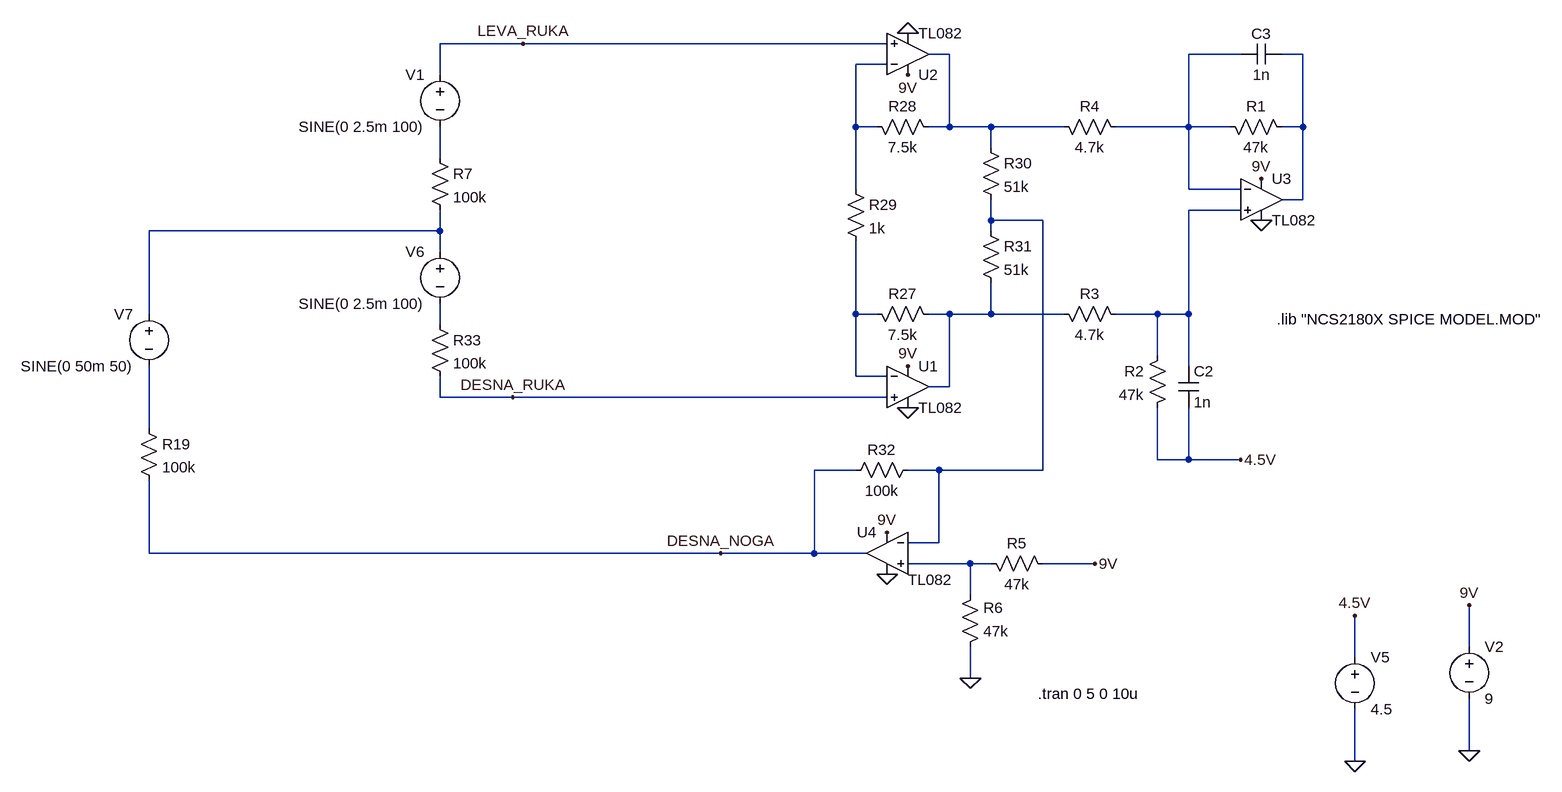
[diagram p0: schematic TL072.asc]
TL072.asc, the LTspice schematic file:
Version 4
SHEET 1 2656 1556
WIRE -1040 -160 -1168 -160
WIRE -480 -160 -1040 -160
WIRE -384 -144 -416 -144
WIRE 64 -144 -16 -144
WIRE 160 -144 128 -144
WIRE -480 -128 -528 -128
WIRE -1168 -112 -1168 -160
WIRE -528 -32 -528 -128
WIRE -496 -32 -528 -32
WIRE -384 -32 -384 -144
WIRE -384 -32 -416 -32
WIRE -320 -32 -384 -32
WIRE -208 -32 -320 -32
WIRE -16 -32 -16 -144
WIRE -16 -32 -128 -32
WIRE 48 -32 -16 -32
WIRE 160 -32 160 -144
WIRE 160 -32 128 -32
WIRE -320 0 -320 -32
WIRE -1168 16 -1168 -32
WIRE -528 64 -528 -32
WIRE -16 64 -16 -32
WIRE 64 64 -16 64
WIRE 160 80 160 -32
WIRE 160 80 128 80
WIRE 64 96 -16 96
WIRE -320 112 -320 80
WIRE -240 112 -320 112
WIRE -1168 128 -1168 96
WIRE -1168 128 -1616 128
WIRE -320 128 -320 112
WIRE -1168 160 -1168 128
WIRE -1616 256 -1616 128
WIRE -528 256 -528 144
WIRE -496 256 -528 256
WIRE -384 256 -416 256
WIRE -320 256 -320 208
WIRE -320 256 -384 256
WIRE -208 256 -320 256
WIRE -64 256 -128 256
WIRE -16 256 -16 96
WIRE -16 256 -64 256
WIRE -1168 272 -1168 240
WIRE -64 320 -64 256
WIRE -16 336 -16 256
WIRE -528 352 -528 256
WIRE -480 352 -528 352
WIRE -384 368 -384 256
WIRE -384 368 -416 368
WIRE -1168 384 -1168 352
WIRE -1056 384 -1168 384
WIRE -480 384 -1056 384
WIRE -1616 432 -1616 336
WIRE -64 480 -64 400
WIRE -16 480 -16 400
WIRE -16 480 -64 480
WIRE 64 480 -16 480
WIRE -528 496 -592 496
WIRE -400 496 -448 496
WIRE -240 496 -240 112
WIRE -240 496 -400 496
WIRE -400 608 -400 496
WIRE -400 608 -448 608
WIRE -1616 624 -1616 512
WIRE -736 624 -1616 624
WIRE -592 624 -592 496
WIRE -592 624 -736 624
WIRE -512 624 -592 624
WIRE -352 640 -448 640
WIRE -320 640 -352 640
WIRE -160 640 -240 640
WIRE -352 688 -352 640
WIRE 416 768 416 704
WIRE 240 784 240 720
WIRE -352 816 -352 768
WIRE 416 928 416 848
WIRE 240 944 240 864
FLAG -448 -176 0
FLAG -448 400 0
FLAG -448 -112 9V
FLAG -448 336 9V
FLAG 416 928 0
FLAG 416 704 9V
FLAG 96 112 0
FLAG 96 48 9V
FLAG -480 656 0
FLAG -480 592 9V
FLAG -160 640 9V
FLAG -352 816 0
FLAG -736 624 DESNA_NOGA
FLAG -1040 -160 LEVA_RUKA
FLAG -1056 384 DESNA_RUKA
FLAG 240 944 0
FLAG 240 720 4.5V
FLAG 64 480 4.5V
SYMBOL ZZZ\\OpAmp\\TL082 -448 368 R0
SYMATTR InstName U1
SYMBOL ZZZ\\OpAmp\\TL082 -448 -144 M180
SYMATTR InstName U2
SYMBOL voltage -1168 -128 M0
WINDOW 123 0 0 Left 0
WINDOW 39 0 0 Left 0
SYMATTR InstName V1
SYMATTR Value SINE(0 2.5m 100)
SYMBOL voltage 416 752 R0
WINDOW 123 0 0 Left 0
WINDOW 39 0 0 Left 0
SYMATTR InstName V2
SYMATTR Value 9
SYMBOL ZZZ\\OpAmp\\TL082 96 80 R0
SYMATTR InstName U3
SYMBOL res 32 -48 M90
WINDOW 0 0 56 VBottom 2
WINDOW 3 32 56 VTop 2
SYMATTR InstName R1
SYMATTR Value 47k
SYMBOL res -48 304 M0
SYMATTR InstName R2
SYMATTR Value 47k
SYMBOL res -112 272 M270
WINDOW 0 32 56 VTop 2
WINDOW 3 0 56 VBottom 2
SYMATTR InstName R3
SYMATTR Value 4.7k
SYMBOL res -112 -16 M270
WINDOW 0 32 56 VTop 2
WINDOW 3 0 56 VBottom 2
SYMATTR InstName R4
SYMATTR Value 4.7k
SYMBOL ZZZ\\OpAmp\\TL082 -480 624 M0
WINDOW 3 -101 41 Left 2
SYMATTR InstName U4
SYMBOL res -224 656 M270
WINDOW 0 32 56 VTop 2
WINDOW 3 0 56 VBottom 2
SYMATTR InstName R5
SYMATTR Value 47k
SYMBOL res -368 784 M180
WINDOW 0 36 76 Left 2
WINDOW 3 36 40 Left 2
SYMATTR InstName R6
SYMATTR Value 47k
SYMBOL cap -32 336 R0
SYMATTR InstName C2
SYMATTR Value 1n
SYMBOL cap 128 -160 R90
WINDOW 0 0 32 VBottom 2
WINDOW 3 32 32 VTop 2
SYMATTR InstName C3
SYMATTR Value 1n
SYMBOL res -1184 0 R0
SYMATTR InstName R7
SYMATTR Value 100k
SYMBOL res -1632 416 R0
SYMATTR InstName R19
SYMATTR Value 100k
SYMBOL voltage 240 768 R0
WINDOW 123 0 0 Left 0
WINDOW 39 0 0 Left 0
SYMATTR InstName V5
SYMATTR Value 4.5
SYMBOL res -400 -16 M270
WINDOW 0 32 56 VTop 2
WINDOW 3 0 56 VBottom 2
SYMATTR InstName R28
SYMATTR Value 7.5k
SYMBOL res -400 272 M270
WINDOW 0 32 56 VTop 2
WINDOW 3 0 56 VBottom 2
SYMATTR InstName R27
SYMATTR Value 7.5k
SYMBOL res -544 48 R0
SYMATTR InstName R29
SYMATTR Value 1k
SYMBOL res -336 -16 R0
SYMATTR InstName R30
SYMATTR Value 51k
SYMBOL res -336 112 R0
SYMATTR InstName R31
SYMATTR Value 51k
SYMBOL res -432 480 R90
WINDOW 0 0 56 VBottom 2
WINDOW 3 32 56 VTop 2
SYMATTR InstName R32
SYMATTR Value 100k
SYMBOL voltage -1168 144 M0
WINDOW 123 0 0 Left 0
WINDOW 39 0 0 Left 0
SYMATTR InstName V6
SYMATTR Value SINE(0 2.5m 100)
SYMBOL res -1184 256 R0
SYMATTR InstName R33
SYMATTR Value 100k
SYMBOL voltage -1616 240 M0
WINDOW 123 0 0 Left 0
WINDOW 39 0 0 Left 0
SYMATTR InstName V7
SYMATTR Value SINE(0 50m 50)
TEXT -248 840 Left 2 !.tran 0 5 0 10u
TEXT 120 264 Left 2 !.lib "NCS2180X SPICE MODEL.MOD"

The netlist it stands for:
* TL072.asc
* U1: TL082 (symbol ZZZ\OpAmp\TL082 not available, pins judged from their places): In+=DESNA_RUKA In-=N009 V+=9V V-=0 OUT=N010
* U2: TL082 (symbol ZZZ\OpAmp\TL082 not available, pins judged from their places): In+=LEVA_RUKA In-=N004 V+=9V V-=0 OUT=N001
V1 LEVA_RUKA N005 SINE(0 2.5m 100)
V2 9V 0 9
* U3: TL082 (symbol ZZZ\OpAmp\TL082 not available, pins judged from their places): In+=N006 In-=N002 V+=9V V-=0 OUT=N003
R1 N002 N003 47k
R2 N006 4.5V 47k
R3 N006 N010 4.7k
R4 N002 N001 4.7k
* U4: TL082 (symbol ZZZ\OpAmp\TL082 not available, pins judged from their places): In+=N013 In-=N007 V+=9V V-=0 OUT=DESNA_NOGA
R5 9V N013 47k
R6 0 N013 47k
C2 N006 4.5V 1n
C3 N003 N002 1n
R7 N005 N008 100k
R19 N012 DESNA_NOGA 100k
V5 4.5V 0 4.5
R28 N001 N004 7.5k
R27 N010 N009 7.5k
R29 N004 N009 1k
R30 N001 N007 51k
R31 N007 N010 51k
R32 N007 DESNA_NOGA 100k
V6 N008 N011 SINE(0 2.5m 100)
R33 N011 DESNA_RUKA 100k
V7 N008 N012 SINE(0 50m 50)
.tran 0 5 0 10u
.lib "NCS2180X SPICE MODEL.MOD"
.backanno
.end